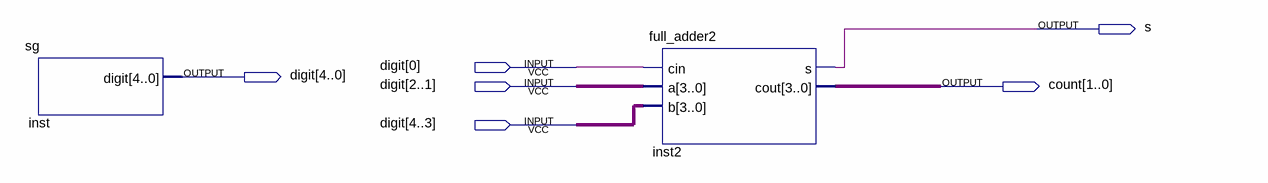
[diagram p0: schematic sheet]
// Quartus schematic tb_top.bdf as structural Verilog: 2 symbols, 6 pins
module tb_top (
  inout  [4:0] digit,
  output s,
  output [1:0] count
);

  sg inst (.digit(digit));
  full_adder2 inst2 (.cin(digit[0]), .a(digit[2:1]), .b(digit[4:3]), .s(s), .cout(count));
endmodule
